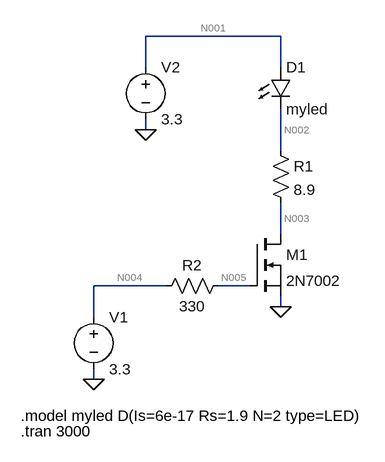
[diagram p0: schematic transmitter.asc]
transmitter.asc, the LTspice schematic file:
Version 4
SHEET 1 880 680
WIRE 224 -176 16 -176
WIRE 16 -128 16 -176
WIRE 224 -128 224 -176
WIRE 16 -32 16 -48
WIRE 224 0 224 -64
WIRE 224 128 224 80
WIRE 48 208 -64 208
WIRE 176 208 128 208
WIRE 224 240 224 224
WIRE -64 256 -64 208
WIRE -64 352 -64 336
FLAG 16 -32 0
FLAG 224 240 0
FLAG -64 352 0
SYMBOL nmos 176 128 R0
SYMATTR InstName M1
SYMATTR Value 2N7002
SYMBOL LED 208 -128 R0
SYMATTR InstName D1
SYMATTR Value myled
SYMBOL res 208 -16 R0
SYMATTR InstName R1
SYMATTR Value 8.9
SYMBOL voltage -64 240 R0
SYMATTR InstName V1
SYMATTR Value 3.3
SYMBOL voltage 16 -144 R0
SYMATTR InstName V2
SYMATTR Value 3.3
SYMBOL res 144 192 R90
WINDOW 0 0 56 VBottom 2
WINDOW 3 32 56 VTop 2
SYMATTR InstName R2
SYMATTR Value 330
TEXT -176 408 Left 2 !.model myled D(Is=6e-17 Rs=1.9 N=2 type=LED)
TEXT -176 432 Left 2 !.tran 3000

The netlist it stands for:
* transmitter.asc
M1 N003 N005 0 0 2N7002
D1 N001 N002 myled
R1 N002 N003 8.9
V1 N004 0 3.3
V2 N001 0 3.3
R2 N005 N004 330
.model D D
.lib standard.dio
.model NMOS NMOS
.model PMOS PMOS
.lib standard.mos
.model myled D(Is=6e-17 Rs=1.9 N=2 type=LED)
.tran 3000
.backanno
.end

* Results of the author's LTspice run, read from the files saved beside the schematic
* Operating Point, zero values left out:
*   V(n003) = 406.9 mV
*   V(n005) = 3.3 V
*   V(n001) = 3.3 V
*   V(n002) = 1.297 V
*   V(n004) = 3.3 V
*   Id(M1) = 99.99 mA
*   Is(M1) = -99.99 mA
*   I(D1) = 99.99 mA
*   I(R1) = 99.99 mA
*   I(V2) = -99.99 mA